# Altium schematic sheet Sheet1.SchDoc
size A4
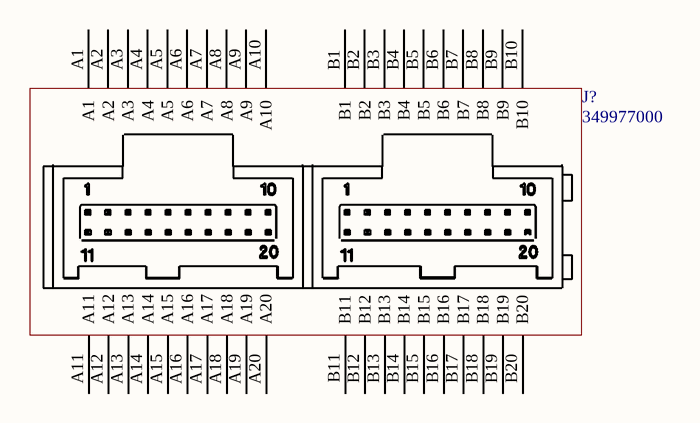
[diagram p0: Sheet1.SchDoc]

## Parts
J?  349977000  [349977000]

## Nets

Not connected (* = marked no-connect by the designer): J? A1 A2 A3 A4 A5 A6 A7 A8 A9 A10 A11 A12 A13 A14 A15 A16 A17 A18 A19 A20 B1 B2 B3 B4 B5 B6 B7 B8 B9 B10 B11 B12 B13 B14 B15 B16 B17 B18 B19 B20

## Library data of the parts
J? = 349977000: 2 BAY STAC64 RIGHT ANGLE HEADER ASSEMBLY; Manufacturer: Molex; OrderNo: 349977000